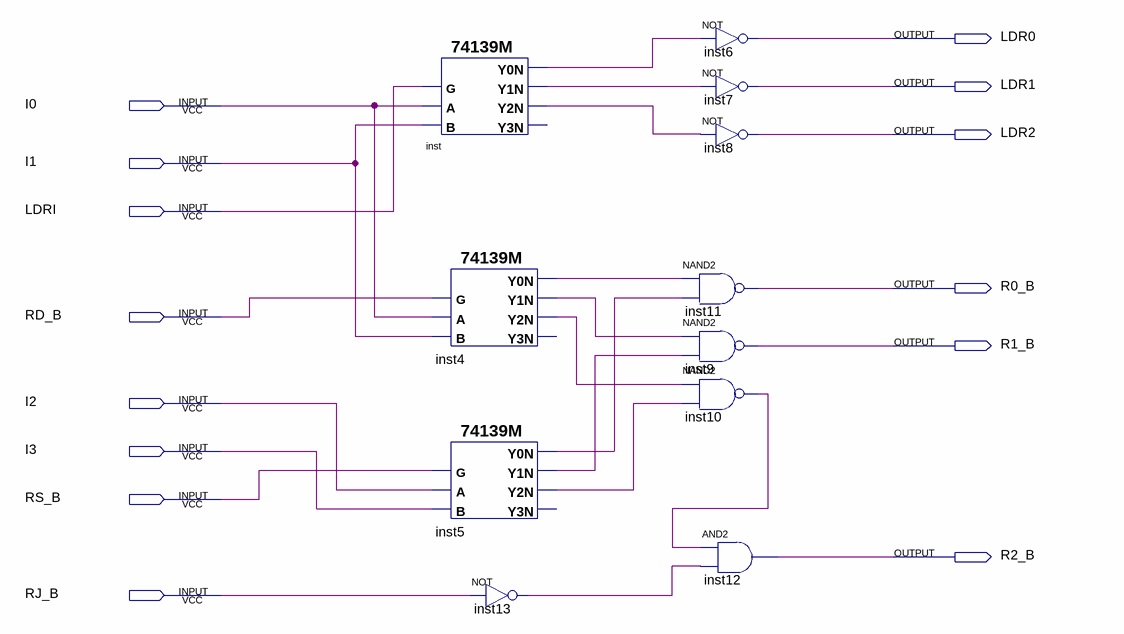
[diagram p0: schematic sheet]
// Quartus schematic LDR0_2.bdf as structural Verilog: 11 symbols, 14 pins
module LDR0_2 (
  input  I0,
  input  I1,
  input  LDRI,
  input  RD_B,
  input  I2,
  input  I3,
  input  RS_B,
  input  RJ_B,
  output LDR0,
  output LDR1,
  output LDR2,
  output R0_B,
  output R1_B,
  output R2_B
);

  wire inst4_y0n, inst4_y1n, inst4_y2n, inst5_y0n, inst5_y1n, inst5_y2n, inst10_out, inst13_out, inst_y0n,
       inst_y1n, inst_y2n;

  \74139M  inst (.B(I1), .A(I0), .G(LDRI), .Y2N(inst_y2n), .Y0N(inst_y0n), .Y1N(inst_y1n));  // open: Y3N
  \74139M  inst4 (.B(I1), .A(I0), .G(RD_B), .Y2N(inst4_y2n), .Y0N(inst4_y0n), .Y1N(inst4_y1n));  // open: Y3N
  \74139M  inst5 (.B(I3), .A(I2), .G(RS_B), .Y2N(inst5_y2n), .Y0N(inst5_y0n), .Y1N(inst5_y1n));  // open: Y3N
  not inst13 (inst13_out, RJ_B);
  nand inst11 (R0_B, inst4_y0n, inst5_y0n);
  nand inst9 (R1_B, inst4_y1n, inst5_y1n);
  nand inst10 (inst10_out, inst4_y2n, inst5_y2n);
  not inst6 (LDR0, inst_y0n);
  not inst7 (LDR1, inst_y1n);
  not inst8 (LDR2, inst_y2n);
  and inst12 (R2_B, inst10_out, inst13_out);
endmodule
